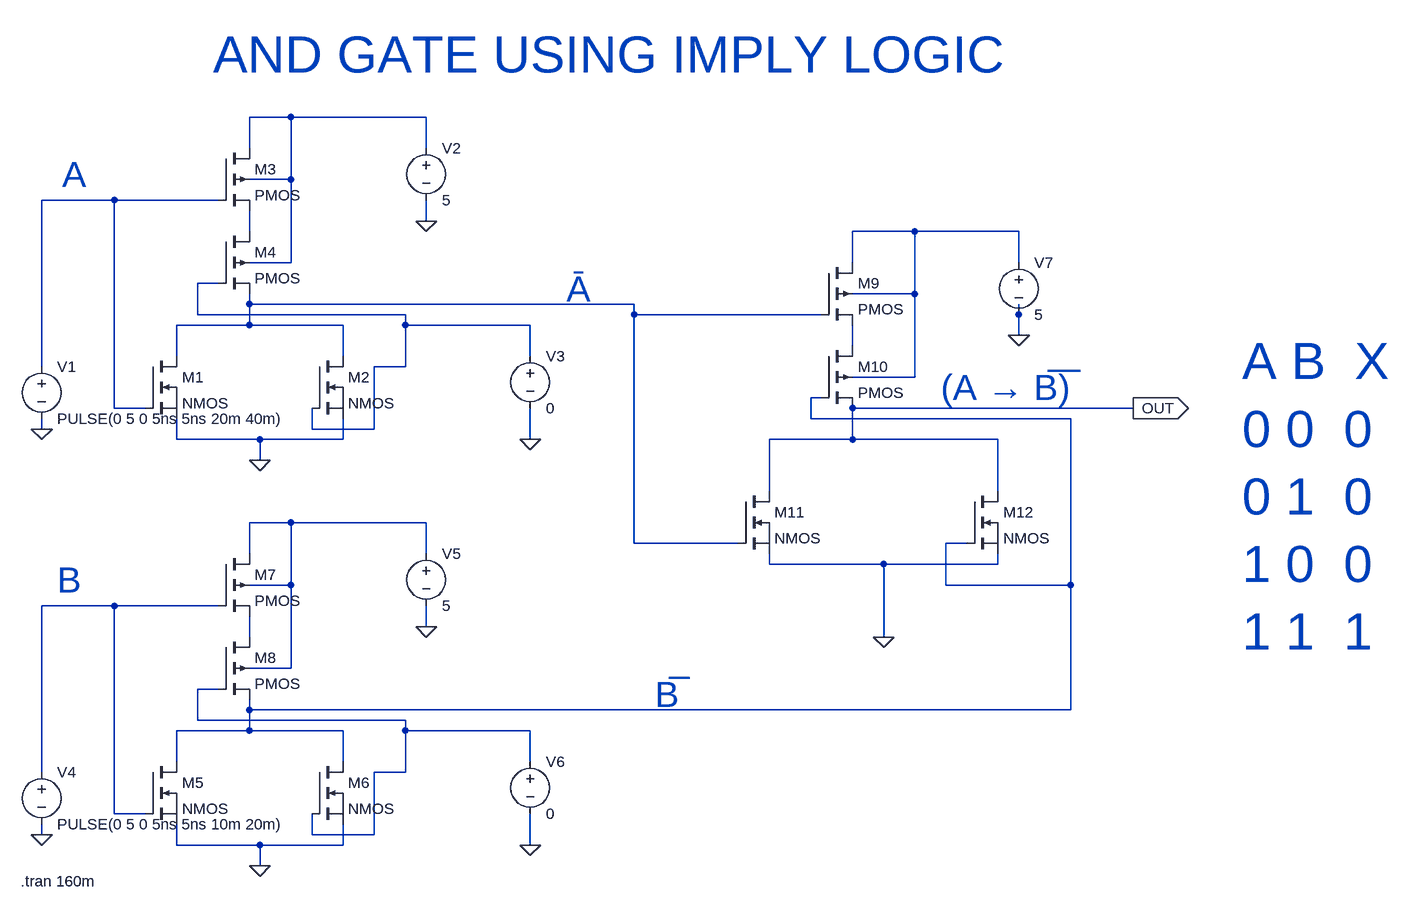
[diagram p0: schematic originalandgateimply.asc]
originalandgateimply.asc, the LTspice schematic file:
Version 4
SHEET 1 2920 984
WIRE 144 -208 80 -208
WIRE 352 -208 144 -208
WIRE 80 -160 80 -208
WIRE 352 -160 352 -208
WIRE 144 -112 144 -208
WIRE 144 -112 80 -112
WIRE -128 -80 -240 -80
WIRE 32 -80 -128 -80
WIRE 352 -48 352 -80
WIRE 80 -32 80 -64
WIRE 1104 -32 1008 -32
WIRE 1264 -32 1104 -32
WIRE 144 16 144 -112
WIRE 144 16 80 16
WIRE 1008 16 1008 -32
WIRE 1264 16 1264 -32
WIRE 32 48 0 48
WIRE 1104 64 1104 -32
WIRE 1104 64 1008 64
WIRE 80 80 80 64
WIRE 672 80 80 80
WIRE 0 96 0 48
WIRE 320 96 0 96
WIRE 672 96 672 80
WIRE 960 96 672 96
WIRE 1264 96 1264 80
WIRE 80 112 80 80
WIRE 80 112 -32 112
WIRE 224 112 80 112
WIRE 320 112 320 96
WIRE 512 112 320 112
WIRE 1264 128 1264 96
WIRE 1008 144 1008 112
WIRE -32 160 -32 112
WIRE 224 160 224 112
WIRE 512 160 512 112
WIRE -240 176 -240 -80
WIRE 320 176 320 112
WIRE 320 176 272 176
WIRE 1104 192 1104 64
WIRE 1104 192 1008 192
WIRE 960 224 944 224
WIRE -128 240 -128 -80
WIRE -80 240 -128 240
WIRE 1440 240 1008 240
WIRE 944 256 944 224
WIRE 1344 256 944 256
WIRE -240 272 -240 256
WIRE 176 272 176 240
WIRE 272 272 272 176
WIRE 272 272 176 272
WIRE -32 288 -32 256
WIRE 96 288 -32 288
WIRE 224 288 224 256
WIRE 224 288 96 288
WIRE 512 288 512 240
WIRE 1008 288 1008 240
WIRE 1008 288 880 288
WIRE 1232 288 1008 288
WIRE 96 320 96 288
WIRE 880 368 880 288
WIRE 1232 368 1232 288
WIRE 144 416 80 416
WIRE 352 416 144 416
WIRE 672 448 672 96
WIRE 832 448 672 448
WIRE 1184 448 1152 448
WIRE 80 464 80 416
WIRE 352 464 352 416
WIRE 880 480 880 464
WIRE 1056 480 880 480
WIRE 1232 480 1232 464
WIRE 1232 480 1056 480
WIRE 144 512 144 416
WIRE 144 512 80 512
WIRE 1152 512 1152 448
WIRE 1344 512 1344 256
WIRE 1344 512 1152 512
WIRE -128 544 -240 544
WIRE 32 544 -128 544
WIRE 352 576 352 544
WIRE 80 592 80 560
WIRE 1056 592 1056 480
WIRE 144 640 144 512
WIRE 144 640 80 640
WIRE 32 672 0 672
WIRE 80 704 80 688
WIRE 1344 704 1344 512
WIRE 1344 704 80 704
WIRE 0 720 0 672
WIRE 320 720 0 720
WIRE 80 736 80 704
WIRE 80 736 -32 736
WIRE 224 736 80 736
WIRE 320 736 320 720
WIRE 512 736 320 736
WIRE -32 784 -32 736
WIRE 224 784 224 736
WIRE 512 784 512 736
WIRE -240 800 -240 544
WIRE 320 800 320 736
WIRE 320 800 272 800
WIRE -128 864 -128 544
WIRE -80 864 -128 864
WIRE -240 896 -240 880
WIRE 176 896 176 864
WIRE 272 896 272 800
WIRE 272 896 176 896
WIRE -32 912 -32 880
WIRE 96 912 -32 912
WIRE 224 912 224 880
WIRE 224 912 96 912
WIRE 512 912 512 864
WIRE 96 944 96 912
FLAG 352 -48 0
FLAG 96 320 0
FLAG -240 272 0
FLAG 512 288 0
FLAG 352 576 0
FLAG 96 944 0
FLAG -240 896 0
FLAG 512 912 0
FLAG 1056 592 0
FLAG 1264 128 0
FLAG 1440 240 OUT
IOPIN 1440 240 Out
SYMBOL nmos -80 160 R0
SYMATTR InstName M1
SYMBOL voltage -240 160 R0
WINDOW 123 0 0 Left 0
WINDOW 39 0 0 Left 0
SYMATTR InstName V1
SYMATTR Value PULSE(0 5 0 5ns 5ns 20m 40m)
SYMBOL voltage 352 -176 R0
WINDOW 123 0 0 Left 0
WINDOW 39 0 0 Left 0
SYMATTR InstName V2
SYMATTR Value 5
SYMBOL voltage 512 144 R0
WINDOW 123 0 0 Left 0
WINDOW 39 0 0 Left 0
SYMATTR InstName V3
SYMATTR Value 0
SYMBOL nmos 176 160 R0
SYMATTR InstName M2
SYMBOL pmos4 32 -160 R0
SYMATTR InstName M3
SYMBOL pmos4 32 -32 R0
SYMATTR InstName M4
SYMBOL nmos -80 784 R0
SYMATTR InstName M5
SYMBOL voltage -240 784 R0
WINDOW 123 0 0 Left 0
WINDOW 39 0 0 Left 0
SYMATTR InstName V4
SYMATTR Value PULSE(0 5 0 5ns 5ns 10m 20m)
SYMBOL voltage 352 448 R0
WINDOW 123 0 0 Left 0
WINDOW 39 0 0 Left 0
SYMATTR InstName V5
SYMATTR Value 5
SYMBOL voltage 512 768 R0
WINDOW 123 0 0 Left 0
WINDOW 39 0 0 Left 0
SYMATTR InstName V6
SYMATTR Value 0
SYMBOL nmos 176 784 R0
SYMATTR InstName M6
SYMBOL pmos4 32 464 R0
SYMATTR InstName M7
SYMBOL pmos4 32 592 R0
SYMATTR InstName M8
SYMBOL pmos4 960 16 R0
SYMATTR InstName M9
SYMBOL pmos4 960 144 R0
SYMATTR InstName M10
SYMBOL nmos 832 368 R0
SYMATTR InstName M11
SYMBOL nmos 1184 368 R0
SYMATTR InstName M12
SYMBOL voltage 1264 0 R0
WINDOW 123 0 0 Left 0
WINDOW 39 0 0 Left 0
SYMATTR InstName V7
SYMATTR Value 5
TEXT -272 968 Left 2 !.tran 160m
TEXT -208 -120 Left 5 ;A
TEXT -216 504 Left 5 ;B
TEXT 568 56 Left 5 ;Ā
TEXT 704 680 Left 5 ;B̅
TEXT 1144 208 Left 5 ;(A → B̅)̅
TEXT 1608 168 Left 6 ;A B  X\n0 0  0\n0 1  0\n1 0  0\n1 1  1
TEXT 24 -304 Left 6 ;AND GATE USING IMPLY LOGIC

The netlist it stands for:
* originalandgateimply.asc
M1 N006 N002 0 0 NMOS
V1 N002 0 PULSE(0 5 0 5ns 5ns 20m 40m)
V2 N001 0 5
V3 N005 0 0
M2 N006 N005 0 0 NMOS
M3 N001 N002 N003 N001 PMOS
M4 N003 N005 N006 N001 PMOS
M5 N008 N010 0 0 NMOS
V4 N010 0 PULSE(0 5 0 5ns 5ns 10m 20m)
V5 N009 0 5
V6 N012 0 0
M6 N008 N012 0 0 NMOS
M7 N009 N010 N011 N009 PMOS
M8 N011 N012 N008 N009 PMOS
M9 N004 N006 N007 N004 PMOS
M10 N007 N008 OUT N004 PMOS
M11 OUT N006 0 0 NMOS
M12 OUT N008 0 0 NMOS
V7 N004 0 5
.model NMOS NMOS
.model PMOS PMOS
.lib standard.mos
.tran 160m
* A
* B
* Ā
* B̅
* (A → B̅)̅
* A B  X
* 0 0  0
* 0 1  0
* 1 0  0
* 1 1  1
* AND GATE USING IMPLY LOGIC
.backanno
.end